# Altium schematic sheet [4] NoHV_RelaysClosed.SchDoc
size A4
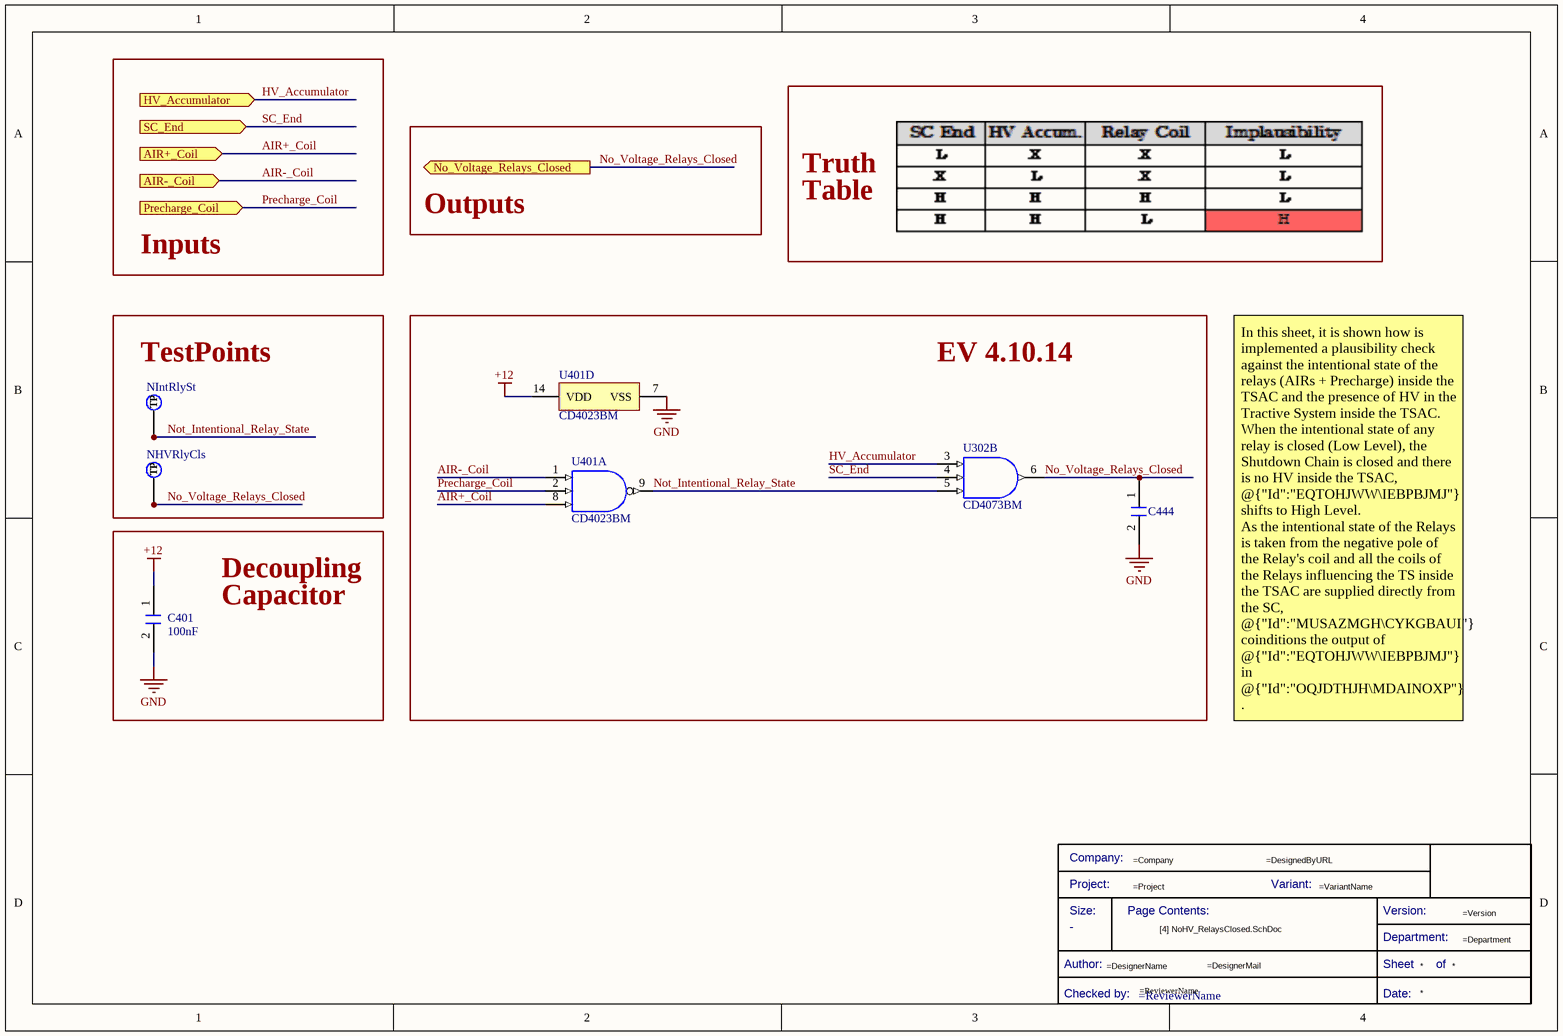
[diagram p0: [4] NoHV_RelaysClosed.SchDoc]

## Parts
*  Title Block_template  (value not drawn)  (graphical)
C401  value 100nF  [C0805FNPC-R]  (hidden comment: C100n-50V-0805FNPC-X7R)
C444  C15p-50V-0805FNPC-NP0  [C0805FNPC-R]  (value not drawn)
NHVRlyCls  TestPoint  [TestPoint]  (value not drawn)  (no BOM)
NIntRlySt  TestPoint  [TestPoint]  (value not drawn)  (no BOM)
U302  CD4073BM  [D0014A_N]  (part B of 4)
U401  CD4023BM  [D0014A_N]  (parts A,D of 4)

## Blocks framed on the sheet
TestPoints: NHVRlyCls NIntRlySt
EV 4.10.14: C444 U302 U401

## Ports
AIR+_Coil (in, see [2] Implausibilities[3B], [1] TSAL_Green[2A], [2] Implausibilities[1A], [3] Relay Implausibility[1A]), AIR-_Coil (in, see [2] Implausibilities[3B], [1] TSAL_Green[2A], [2] Implausibilities[1A], [3] Relay Implausibility[1A]), HV_Accumulator (in, see [2] Implausibilities[3B], [1] TSAL_Green[2B], [2] Implausibilities[1A], [5] SCS[1A]), No_Voltage_Relays_Closed (out, see [2] Implausibilities[4B]), Precharge_Coil (in, see [2] Implausibilities[3B], [1] TSAL_Green[2B], [2] Implausibilities[1A], [3] Relay Implausibility[1A]), SC_End (in, see [2] Implausibilities[3B], [1] TSAL_Green[2B], [2] Implausibilities[1A], [3] Relay Implausibility[1B])

## Nets
+12: C401.1 U401.14(VDD)
GND: C401.2 C444.2 U401.7(VSS)
AIR+_Coil: U401.8(C) ; port AIR+_Coil
AIR-_Coil: U401.1(A) ; port AIR-_Coil
HV_Accumulator: U302.3(D) ; port HV_Accumulator
No_Voltage_Relays_Closed: C444.1 NHVRlyCls.1(TP) U302.6(K) ; port No_Voltage_Relays_Closed
Not_Intentional_Relay_State: NIntRlySt.1(TP) U302.5(F) U401.9(J)
Precharge_Coil: U401.2(B) ; port Precharge_Coil
SC_End: U302.4(E) ; port SC_End

## Notes on the sheet
- Truth
- Outputs
- Table
- Inputs
- Decoupling
- Capacitor
- In this sheet, it is shown how is implemented a plausibility check against the intentional state of the relays (AIRs + Precharge) inside the TSAC and the presence of HV in the Tractive System inside the TSAC.
  When the intentional state of any relay is closed (Low Level), the Shutdown Chain is closed and there is no HV inside the TSAC, @{"Id":"EQTOHJWW\IEBPBJMJ"} shifts to High Level.
  As the intentional state of the Relays is taken from the negative pole of the Relay's coil and all the coils of the Relays influencing the TS inside the TSAC are supplied directly from the SC, @{"Id":"MUSAZMGH\CYKGBAUI"} coinditions the output of @{"Id":"EQTOHJWW\IEBPBJMJ"} in @{"Id":"OQJDTHJH\MDAINOXP"} .
- (in symbol CMP-00043-8) Company:; Project:; Variant:; Size:; Page Contents:; Version:; Department:; Author:; Sheet; of; Checked by:; Date:

## Library data of the parts
* = CMP-00043-8: Standard Title Block; .SCHcheck: GP; Checked by:: =ReviewerName; Size: -; Design Item ID: Title Block_template; .PCBcheck: GP; .Creator: GP; Source: e-Tech_Racing.SchLib; Category: Title Block
C401 = CMP-00063-3: Cap, 0.1ΜF, 50V, 10%, X7R, 0805; Manufacturer Part Number 1: 885012207098; Manufacturer 1: Wurth Electronics; .Creator: DR; ComponentLink2Description: http://www.farnell.com/datasheets/1958498.pdf?src-supplier=Element14; ComponentLink1Description: http://www.farnell.com/datasheets/1958498.pdf?src-supplier=Farnell; Thickness: 0.035inch; ComponentLink1URL: http://www.farnell.com/datasheets/1958498.pdf?src-supplier=Farnell; Min Operating Temperature: -55°C; Packaging: Cut Tape; ComponentLink2URL: http://www.farnell.com/datasheets/1958498.pdf?src-supplier=Element14; Mount: Surface Mount; Voltage Rating (DC): 50V; Tolerance: 10%; Category: Ceramic Capacitors; RoHS: Yes; Width: 0.049inch; Pricing 1: 100=0,10200, 500=0,07100, 2000=0,06100 (GBP); RoHS Compliant: Yes; ComponentLink4Description: http://www.farnell.com/datasheets/1958498.pdf?src-supplier=Newark; Dielectric: X7R; Stock 1: 8000; Length: 0.079inch; ComponentLink3URL: https://katalog.we-online.de/pbs/datasheet/885012207098.pdf?src-supplier=Digi-Key; ComponentLink3Description: https://katalog.we-online.de/pbs/datasheet/885012207098.pdf?src-supplier=Digi-Key; Design Item ID: C100n-50V-0805FNPC-X7R; ComponentLink4URL: http://www.farnell.com/datasheets/1958498.pdf?src-supplier=Newark; REACH SVHC: Unknown; Case Code (Metric): 2012; Voltage Rating: 50V; Max Operating Temperature: 125°C; Source: Passives.SchLib; Case/Package: 0805
C444 = CMP-00056-3: Cap, 15PF, 50V, 5%, C0G/NP0, 0805; Manufacturer Part Number 1: 885012007052; Manufacturer 1: Wurth Electronics; .Creator: DR; Thickness: 0.028inch; RoHS Compliant: Yes; ComponentLink2URL: http://katalog.we-online.de/pbs/datasheet/885012007052.pdf?src-supplier=Digi-Key; Design Item ID: C15p-50V-0805FNPC-NP0; Case Code (Metric): 2012; Max Operating Temperature: 125°C; Mount: Surface Mount; Category: Ceramic Capacitors; Min Operating Temperature: -55°C; Case/Package: 0805; ComponentLink3Description: https://katalog.we-online.de/pbs/datasheet/885012007052.pdf?src-supplier=Digi-Key; ComponentLink1Description: http://www.farnell.com/datasheets/2031702.pdf?src-supplier=Farnell; ComponentLink1URL: http://www.farnell.com/datasheets/2031702.pdf?src-supplier=Farnell; RoHS: Yes; Voltage Rating: 50V; Length: 0.079inch; Source: Passives.SchLib; Value: 15pF; Pricing 1: 1=0,10800, 10=0,05200, 25=0,05100, 50=0,04900, 100=0,04800, 250=0,04600, 500=0,04300 (USD); Tolerance: 5%; ComponentLink3URL: https://katalog.we-online.de/pbs/datasheet/885012007052.pdf?src-supplier=Digi-Key; Stock 1: 815; Packaging: Cut Tape; Width: 0.049inch; ComponentLink2Description: http://katalog.we-online.de/pbs/datasheet/885012007052.pdf?src-supplier=Digi-Key
NHVRlyCls NIntRlySt = CMP-00042-2: Test Point 1x1 mm; .SCHcheck: GP; Category: TestPoint; Source: e-Tech_Racing.SchLib; .Creator: GP; .PCBcheck: GP; Design Item ID: TestPoint
U302 = CMP-00213-1: AND Gate, 4000/14000/40000 Series, 3-Func, 3-Input, CMOS, PDSO14; Propagation Delay (tpd): 250ns; Nominal Supply Voltage: 5V; Power Supplies: 5/15V; Qualification Status: Not Qualified; Package Equivalence Code: SOP14,.25; Channels: 3; Min Supply Voltage: 3V; Package Body Material: Plastic; Max Supply Voltage: 18V; Load Capacitance (CL): 50pF; Load/Preset Input: Yes; Schmitt Trigger: No; Terminal Pitch: 1.27mm; Terminal Form: Gull Wing; Length: 8.65mm; Logic Type: AND GATE; Prop. Delay@Nom-Sup: 250ns; Package Style: SMALL OUTLINEMeter; JESD-609 Code: e4; Package Shape: Rectangular; Moisture Sensitivity Level: 1; Max Operating Temperature: 125°C; Min Operating Temperature: -55°C; Case/Package: SOP; Terminal Finish: Nickel; Width: 3.9mm; Surface Mount: Yes; Reach SVHC Compliant: Yes; Technology: CMOS; Terminal Position: DUAL; Height - Seated (Max): 1.75mm; Temperature Grade: MILITARY; Number of Inputs: 3; Packaging: Rail/Tube; Pins: 14; Peak Reflow Temperature (Cel): 260°C; JESD-30 Code: R-PDSO-G14; RoHS Compliant: Yes
U401 = CMP-00215-1: NAND Gate, 4000/14000/40000 Series, 3-Func, 3-Input, CMOS, CDIP14; Min Supply Voltage: 5V; Package Body Material: Metal; Surface Mount: No; Number of Inputs: 3; Max Supply Voltage: 15V; Qualification Status: Not Qualified; Nominal Supply Voltage: 10V; Propagation Delay (tpd): 250ns; Pins: 14; Case/Package: DIP; Terminal Pitch: 2.54mm; Terminal Form: Through Hole; Height - Seated (Max): 5.08mm; Max Operating Temperature: 125°C; Min Operating Temperature: -55°C; Package Shape: Rectangular; Width: 7.62mm; Logic Type: NAND GATE; Technology: CMOS; Channels: 3; Temperature Grade: MILITARY; Terminal Position: DUAL; Package Style: IN-LINEMeter